# EAGLE board SANE v2 (EAGLE 7.6.0)
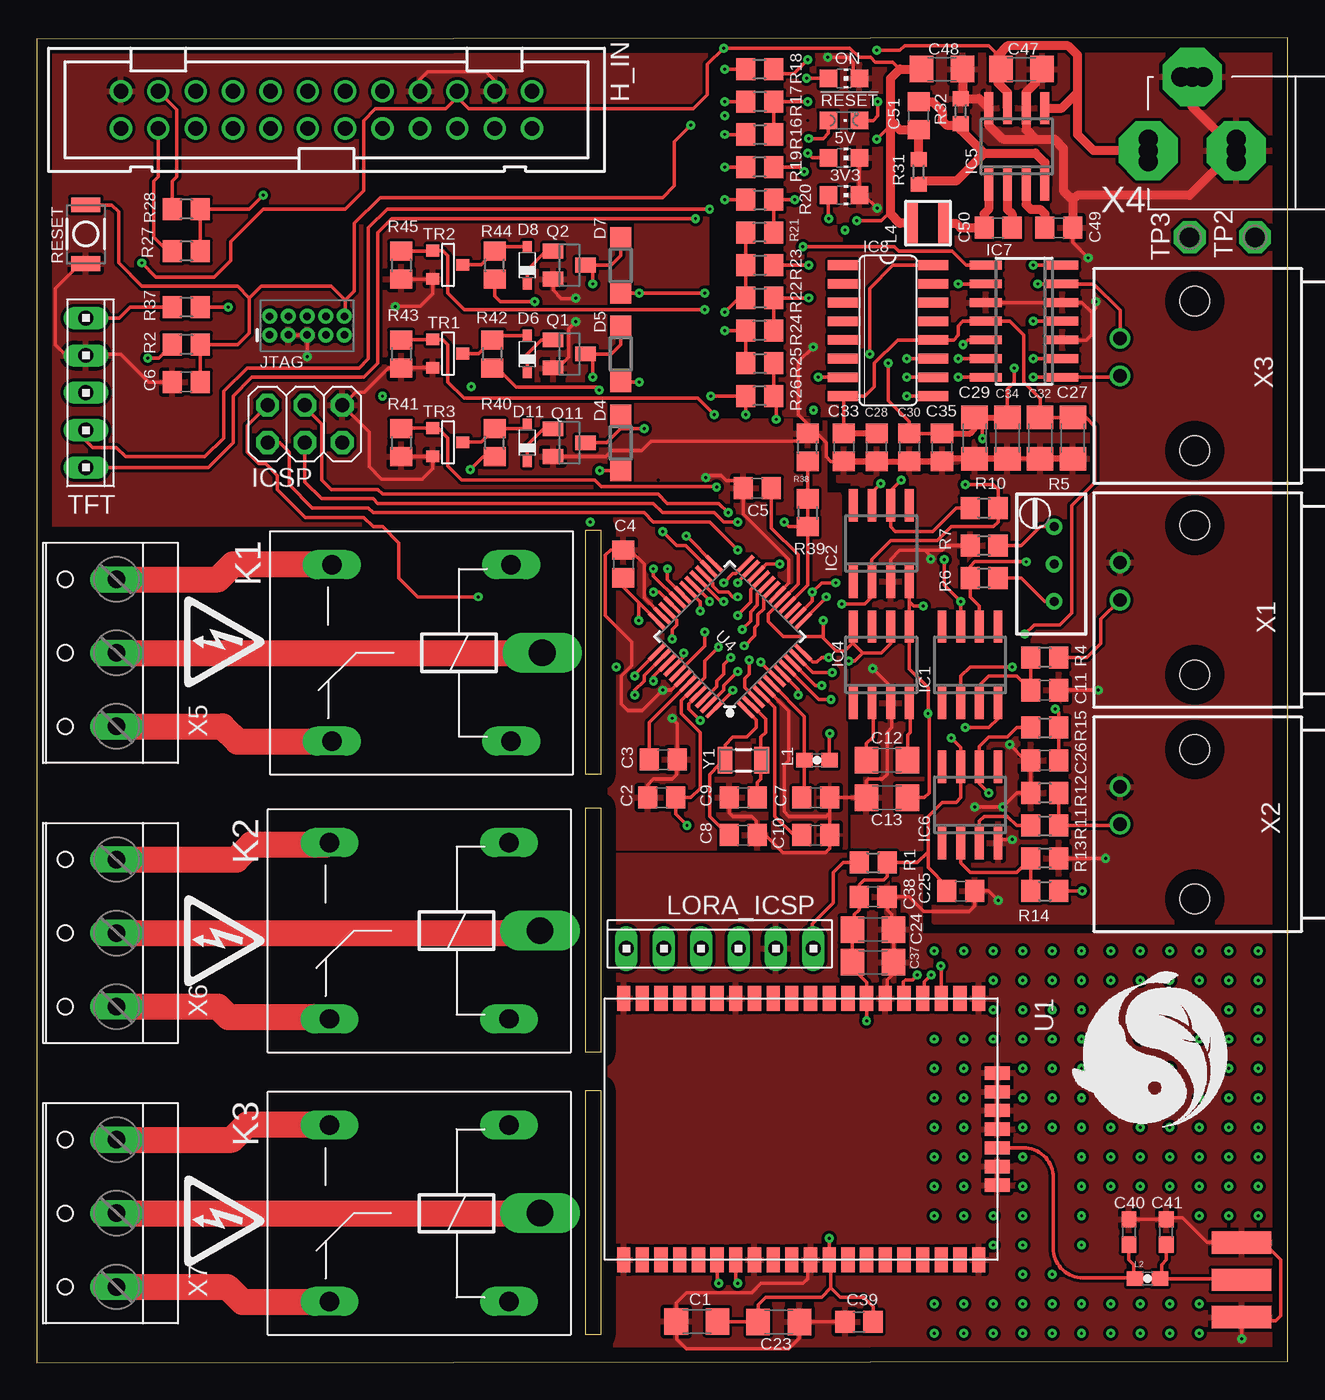
[diagram p1: board, top side]
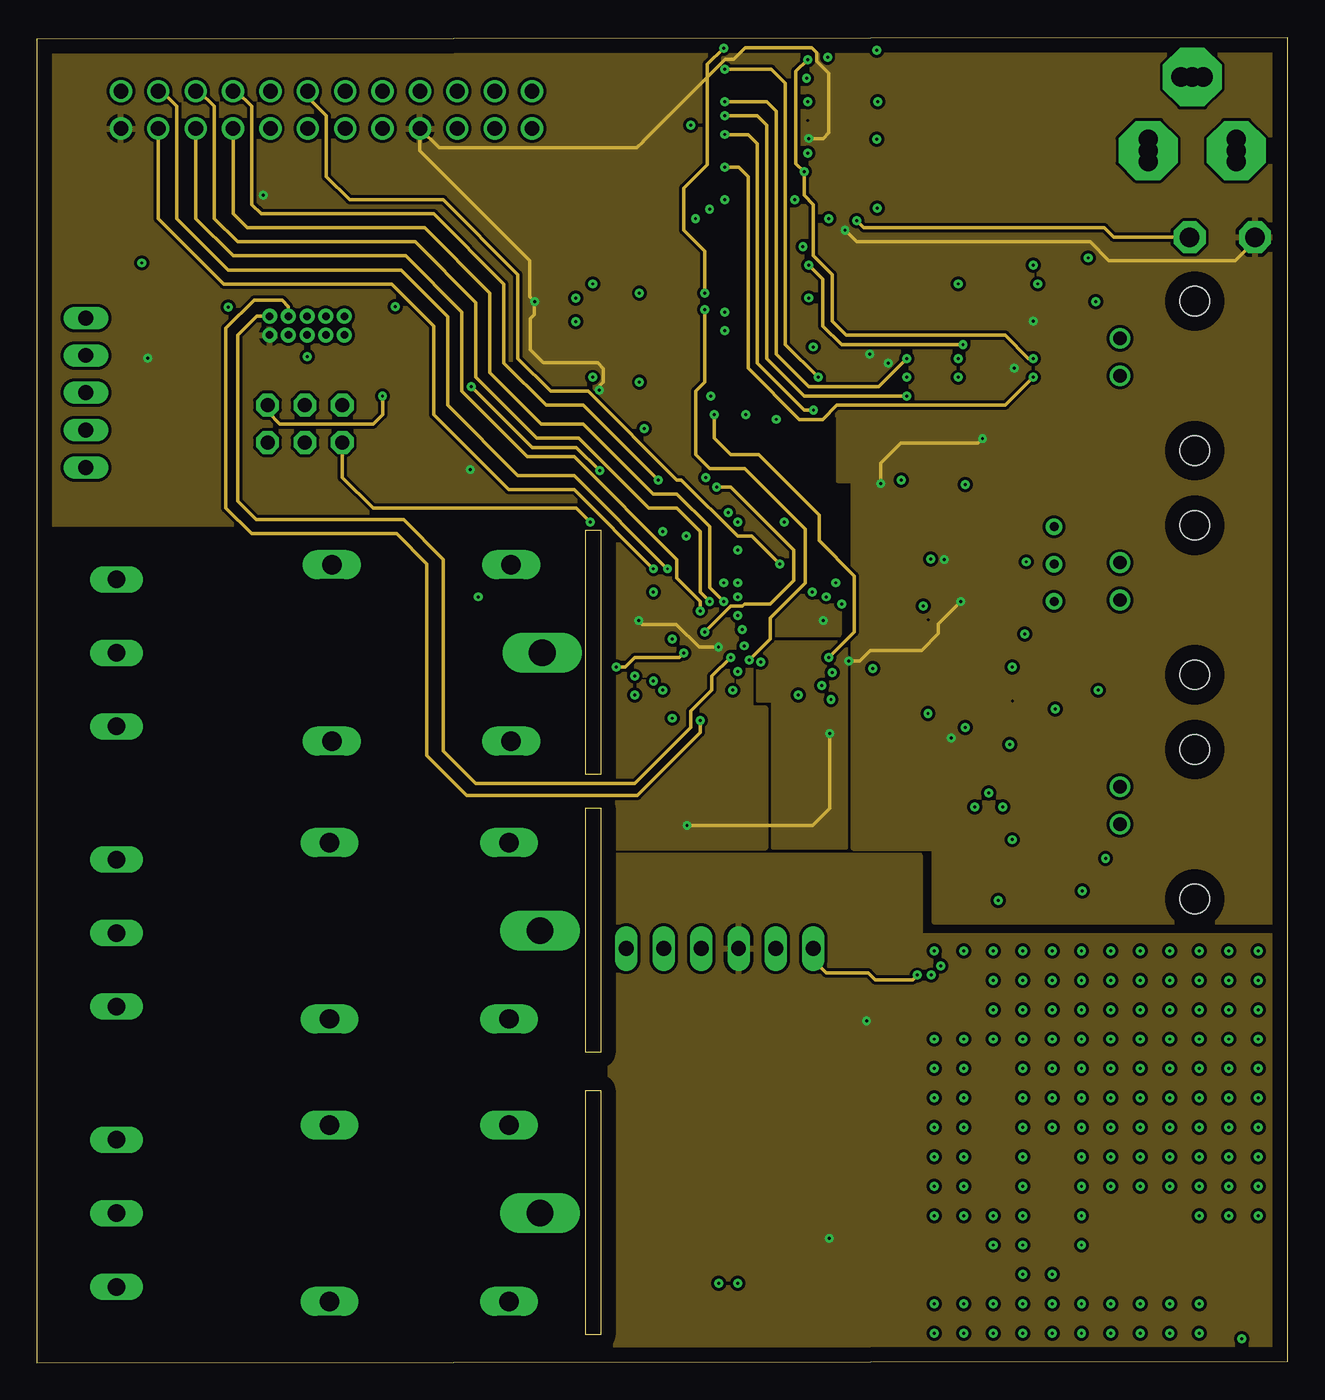
[diagram p2: board, inner layer Power]
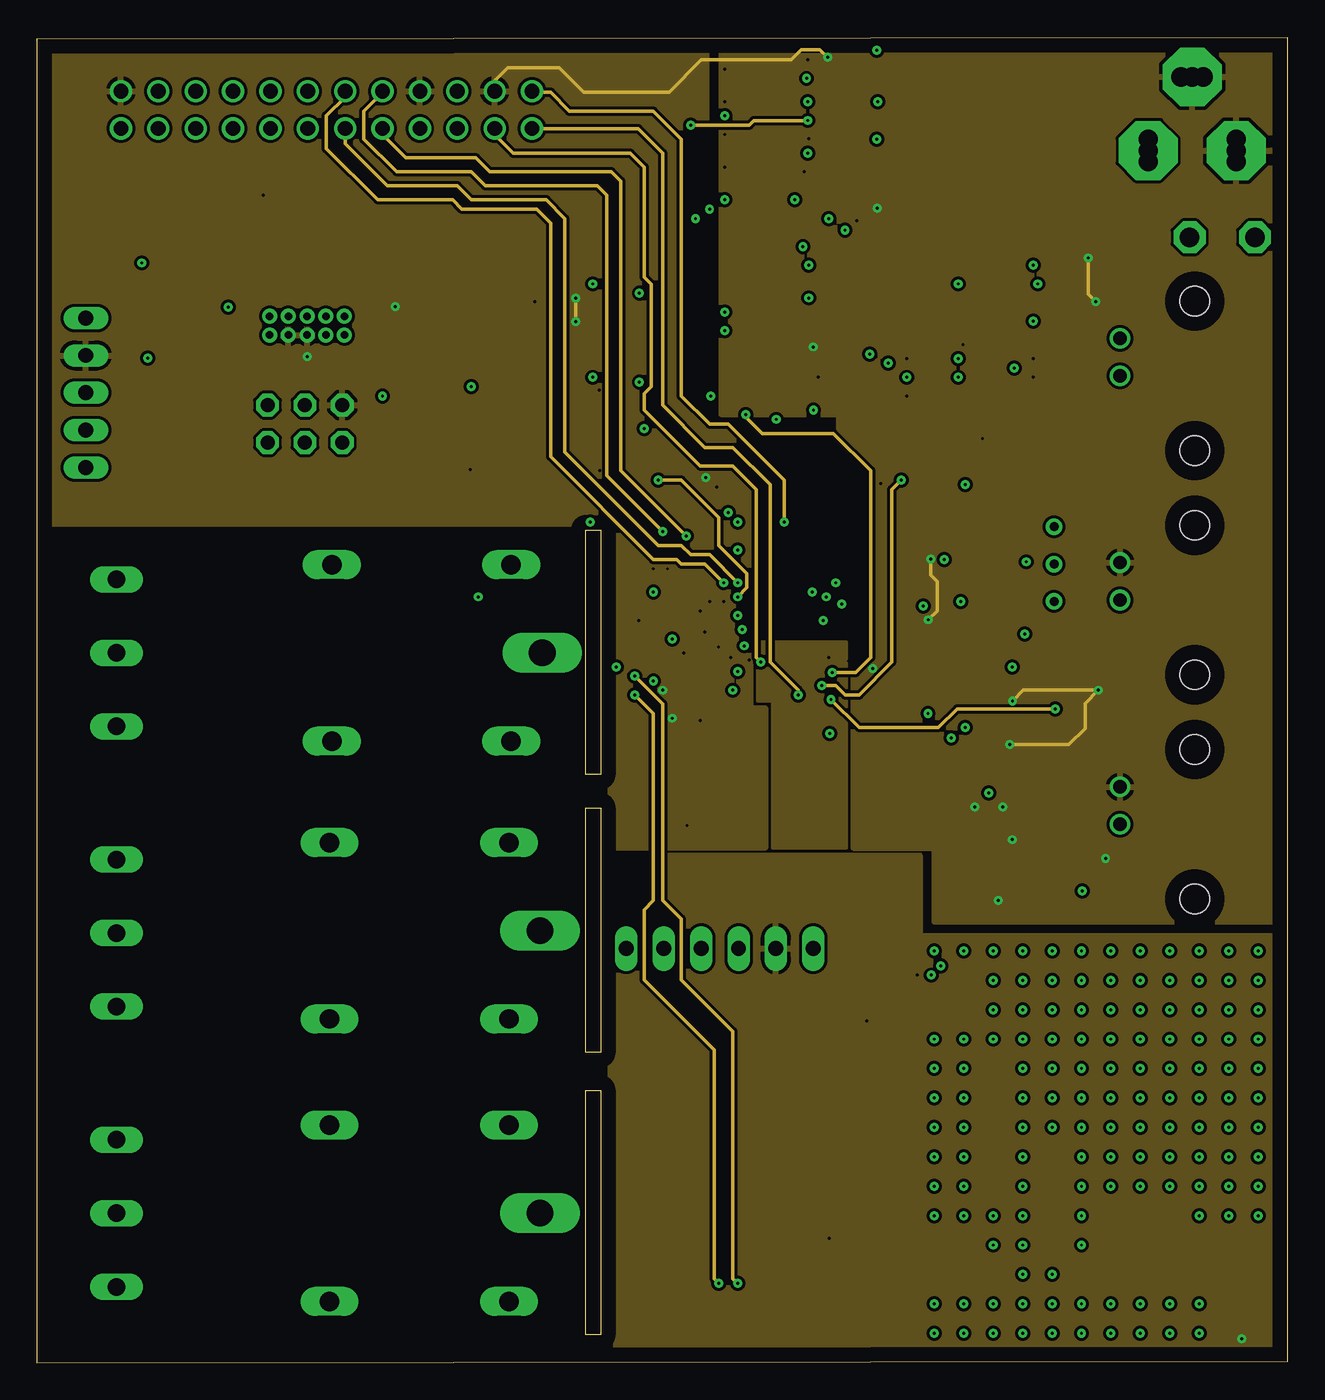
[diagram p3: board, inner layer Signals]
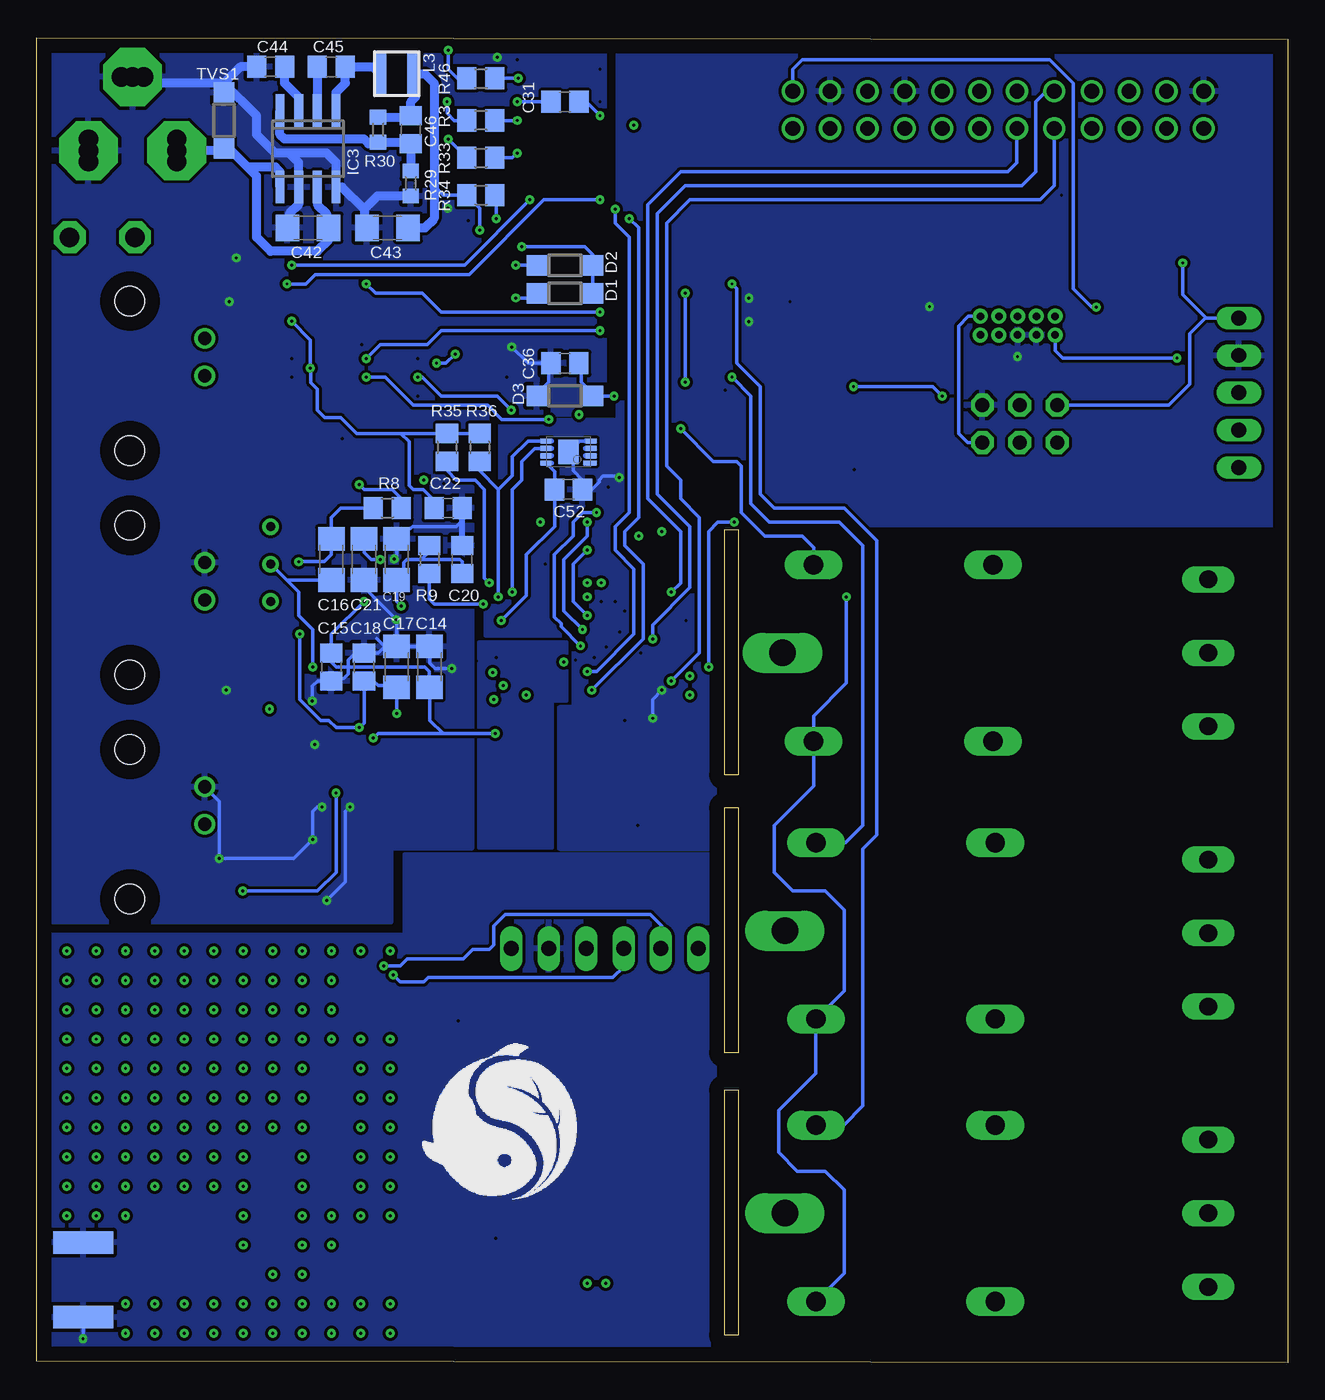
[diagram p4: board, bottom side, seen from below]

Size 85.03 x 90.08 mm. Coordinates in mm from the lower left corner, seen from the top.
Outline: 0,0 85.03,0.1 85.03,90.08 0,89.98 0,0
Outline: 37.32,18.52 38.32,18.52 38.32,1.89 37.32,1.89 37.32,18.52
Outline: 37.32,37.73 38.32,37.73 38.32,21.1 37.32,21.1 37.32,37.73
Outline: 37.32,56.62 38.32,56.62 38.32,39.99 37.32,39.99 37.32,56.62
Copper layers [2:(1*(2*15)*16):15]: Top 0.035mm / dielectric 0.2mm / Power 0.035mm / dielectric 0.3mm / Signals 0.035mm / dielectric 0.2mm / Bottom 0.035mm
Design rules "default *": minimum track width 10mil, minimum drill 24mil, track to track 8mil, track to pad 8mil, pad to pad 8mil, via to via 8mil, smd to smd 8mil, copper to edge 40mil, drill to drill 8mil, minimum pad ring 10mil, minimum via ring 8mil, stop-mask expansion 4mil, vias tented up to drill 0mil, thermal gap 10mil
Net classes: 0 default: width 0.203 mm, drill 0.406 mm, clearance 0.203 mm

## Footprints (pad centres in the part's own frame; a part is rotated, then mirrored left to right if it is on the bottom)
CHIP-LED0805 = smd 1.2 x 1.2: A 0,-1.05; C 0,1.05
CHIPLED_0805 = smd 1.2 x 1.2: A 0,-1.05; C 0,1.05
C1206 = smd 1.6 x 1.8: 1 -1.4,0; 2 1.4,0
C0805 = smd 1.3 x 1.5: 1 -0.95,0; 2 0.95,0
C0603 = smd 1.1 x 1: 1 -0.85,0; 2 0.85,0
SOD123 = smd 1.4 x 1.4: A 1.9,0; C -1.9,0
SOD323_ST = smd 0.8 x 0.6: A 1.25,0; C -1.25,0
PAK100/2500-24 = drill 1 pad 1.422: 1 -13.97,-1.27; 2 -13.97,1.27; 3 -11.43,-1.27; 4 -11.43,1.27; 5 -8.89,-1.27; 6 -8.89,1.27; 7 -6.35,-1.27; 8 -6.35,1.27; 9 -3.81,-1.27; 10 -3.81,1.27; 11 -1.27,-1.27; 12 -1.27,1.27; 13 1.27,-1.27; 14 1.27,1.27; 15 3.81,-1.27; 16 3.81,1.27; 17 6.35,-1.27; 18 6.35,1.27; 19 8.89,-1.27; 20 8.89,1.27; 21 11.43,-1.27; 22 11.43,1.27; 23 13.97,-1.27; 24 13.97,1.27
SO08 = smd 0.6 x 2.2: 1 -1.905,-2.6; 2 -0.635,-2.6; 3 0.635,-2.6; 4 1.905,-2.6; 5 1.905,2.6; 6 0.635,2.6; 7 -0.635,2.6; 8 -1.905,2.6
SO8 = smd 0.6 x 2.2: 1 -1.905,-2.6; 2 -0.635,-2.6; 3 0.635,-2.6; 4 1.905,-2.6; 5 1.905,2.6; 6 0.635,2.6; 7 -0.635,2.6; 8 -1.905,2.6
SO14 = smd 0.6 x 2.2: 1 -3.81,-2.6; 2 -2.54,-2.6; 3 -1.27,-2.6; 4 0,-2.6; 5 1.27,-2.6; 6 2.54,-2.6; 7 3.81,-2.6; 8 3.81,2.6; 9 2.54,2.6; 10 1.27,2.6; 11 0,2.6; 12 -1.27,2.6; 13 -2.54,2.6; 14 -3.81,2.6
SO16 = smd 0.66 x 2.032: 1 -4.445,-3.073; 2 -3.175,-3.073; 3 -1.905,-3.073; 4 -0.635,-3.073; 5 0.635,-3.073; 6 1.905,-3.073; 7 3.175,-3.073; 8 4.445,-3.073; 9 4.445,3.073; 10 3.175,3.073; 11 1.905,3.073; 12 0.635,3.073; 13 -0.635,3.073; 14 -1.905,3.073; 15 -3.175,3.073; 16 -4.445,3.073
2X03 = drill 0.95 pad 1.55 octagon: 1 -2.54,-1.27; 2 -2.54,1.27; 3 0,-1.27; 4 0,1.27; 5 2.54,-1.27; 6 2.54,1.27
2X5-PTH-1.27MM = drill 0.508 pad 1: 1 -2.54,-0.635; 2 -2.54,0.635; 3 -1.27,-0.635; 4 -1.27,0.635; 5 0,-0.635; 6 0,0.635; 7 1.27,-0.635; 8 1.27,0.635; 9 2.54,-0.635; 10 2.54,0.635
ZF112 = drill 1.321 long: 1 -6.096,5.994; 2 -6.096,-5.994; O 6.096,5.994; S 6.096,-5.994 | drill 1.803 long: P -8.204,0
0603 = smd 1.1 x 1: 1 -0.85,0; 2 0.85,0
L-NR3010 = smd 0.9 x 2.7: P$1 -1.15,0; P$2 1.15,0
10X06MTA = drill 1.016 long: 1 6.35,0; 2 3.81,0; 3 1.27,0; 4 -1.27,0; 5 -3.81,0; 6 -6.35,0
SOT23-BEC = smd 1 x 1.4: B -0.95,-1.1; C 0,1.1; E 0.95,-1.1
R0805 = smd 1.3 x 1.5: 1 -0.95,0; 2 0.95,0
RTRIMT93YA = drill 0.61: 1 0,-2.54; 2 0,0; 3 0,2.54
R0603 = smd 1 x 1.1: 1 -0.85,0; 2 0.85,0
SMD_157SW = smd 1.016 x 1.981: 1 0,0; 2 4,0
SMA-EDGE = smd 1.524 x 4.064: GND@0 0,0; GND@1 5.08,0; SIG 2.54,0 | smd 1.524 x 4.064 bottom: GND@2 0,0; GND@3 5.08,0
10X05MTA = drill 1.016 long: 1 5.08,0; 2 2.54,0; 3 0,0; 4 -2.54,0; 5 -5.08,0
P1-13 = drill 1.321 pad 2.159 octagon: TP 0,0
SOT-23 = smd 0.787 x 0.889: 1 0.025,-1.016; 2 -0.94,1.016; 3 0.991,1.016
RN2483/RN2903 = smd 1.7 x 0.9: 1 8.89,-12.7; 2 8.89,-11.43; 3 8.89,-10.16; 4 8.89,-8.89; 5 8.89,-7.62; 6 8.89,-6.35; 7 8.89,-5.08; 8 8.89,-3.81; 9 8.89,-2.54; 10 8.89,-1.27; 11 8.89,0; 12 8.89,1.27; 13 8.89,2.54; 14 8.89,3.81; 15 8.89,5.08; 16 8.89,6.35; 17 8.89,7.62; 18 8.89,8.89; 19 8.89,10.16; 20 8.89,11.43; 28 -8.89,11.43; 29 -8.89,10.16; 30 -8.89,8.89; 31 -8.89,7.62; 32 -8.89,6.35; 33 -8.89,5.08; 34 -8.89,3.81; 35 -8.89,2.54; 36 -8.89,1.27; 37 -8.89,0; 38 -8.89,-1.27; 39 -8.89,-2.54; 40 -8.89,-3.81; 41 -8.89,-5.08; 42 -8.89,-6.35; 43 -8.89,-7.62; 44 -8.89,-8.89; 45 -8.89,-10.16; 46 -8.89,-11.43; 47 -8.89,-12.7 | smd 0.9 x 1.7: 21 3.81,12.7; 22 2.54,12.7; 23 1.27,12.7; 24 0,12.7; 25 -1.27,12.7; 26 -2.54,12.7; 27 -3.81,12.7
SON50P300X200X60-9N-EP160X140 = smd 0.85 x 0.3: 1 -1.45,0.75 | smd 0.7 x 0.3: 2 -1.525,0.25; 3 -1.525,-0.25; 4 -1.525,-0.75; 5 1.525,-0.75; 6 1.525,-0.25; 7 1.525,0.25; 8 1.525,0.75 | smd 1.4 x 1.6: 9 0,0
TQFP-48 = smd 1.5 x 0.28: 1 -4.25,2.75; 2 -4.25,2.25; 3 -4.25,1.75; 4 -4.25,1.25; 5 -4.25,0.75; 6 -4.25,0.25; 7 -4.25,-0.25; 8 -4.25,-0.75; 9 -4.25,-1.25; 10 -4.25,-1.75; 11 -4.25,-2.25; 12 -4.25,-2.75; 25 4.25,-2.75; 26 4.25,-2.25; 27 4.25,-1.75; 28 4.25,-1.25; 29 4.25,-0.75; 30 4.25,-0.25; 31 4.25,0.25; 32 4.25,0.75; 33 4.25,1.25; 34 4.25,1.75; 35 4.25,2.25; 36 4.25,2.75 | smd 0.28 x 1.5: 13 -2.75,-4.25; 14 -2.25,-4.25; 15 -1.75,-4.25; 16 -1.25,-4.25; 17 -0.75,-4.25; 18 -0.25,-4.25; 19 0.25,-4.25; 20 0.75,-4.25; 21 1.25,-4.25; 22 1.75,-4.25; 23 2.25,-4.25; 24 2.75,-4.25; 37 2.75,4.25; 38 2.25,4.25; 39 1.75,4.25; 40 1.25,4.25; 41 0.75,4.25; 42 0.25,4.25; 43 -0.25,4.25; 44 -0.75,4.25; 45 -1.25,4.25; 46 -1.75,4.25; 47 -2.25,4.25; 48 -2.75,4.25
AMP_227161 = drill 0.9 pad 1.27: 1 0,-5.08; 2 -2.54,-5.08 | hole 2: -5.08,0; 5.08,0
POWERSUPPLY_DC-21MM = drill 1.3 pad 4 octagon: 1 -5.08,-3.353; 2 -0.076,-6.35; 3 -0.076,-0.356 | drill 1.3: 4 -5.08,-4.115; 5 -5.08,-2.591; 6 -0.838,-0.356; 7 0.686,-0.356; 8 -0.838,-6.35; 9 0.686,-6.35
W237-103 = drill 1.194 long: 1 -5,-1.29; 2 0,-1.29; 3 5,-1.29
CRYSTAL-SMD-3.2X1.5MM = smd 1 x 1.8: P$1 -1.25,0; P$2 1.25,0

## Placement (x,y rotation side)
3V3  GREEN  [CHIP-LED0805]  54.85,79.38 270 top
5V  GREEN  [CHIP-LED0805]  54.85,81.92 270 top
!RESET  [CHIPLED_0805]  54.85,84.45 270 top
C1  1u  [C1206]  44.86,2.8 180 top
C2  100n  [C0805]  42.47,38.42 180 top
C3  100n  [C0805]  42.58,41.01 0 top
C4  100n  [C0805]  39.86,54.31 90 top
C5  100n  [C0805]  48.97,59.45 180 top
C6  100n  [C0805]  10.16,66.67 180 top
C7  100n  [C0805]  52.94,38.42 180 top
C8  22p  [C0805]  48.02,35.88 180 top
C9  22p  [C0805]  48.02,38.42 0 top
C10  100n  [C0805]  52.94,35.88 180 top
C11  2.2n  [C0805]  68.5,45.72 0 top
C12  100u  [C1206]  57.78,40.96 0 top
C13  100u  [C1206]  57.78,38.42 180 top
C14  10u  [C1206]  58.34,47.31 270 bottom
C15  100n  [C0805]  65.01,47.31 90 bottom
C16  1u  [C1206]  65.01,54.61 90 bottom
C17  10u  [C1206]  60.57,47.31 270 bottom
C18  100n  [C0805]  62.79,47.31 270 bottom
C19  10u  [C1206]  60.57,54.61 270 bottom
C20  100n  [C0805]  56.12,54.61 270 bottom
C21  10u  [C1206]  62.79,54.61 90 bottom
C22  100n  [C0805]  57.08,58.1 180 bottom
C23  10u  [C1206]  50.42,2.77 0 top
C24  1u  [C1206]  56.83,29.45 0 top
C25  100n  [C0805]  62.79,32.07 180 top
C26  10n  [C0805]  68.5,40.96 180 top
C27  10u  [C1206]  70.41,62.87 90 top
C28  100n  [C0805]  57.08,62.23 90 top
C29  10u  [C1206]  63.74,62.87 90 top
C30  100n  [C0805]  59.3,62.23 90 top
C31  100n  [C0805]  49.13,85.72 180 bottom
C32  10u  [C1206]  68.19,62.87 90 top
C33  100n  [C0805]  54.85,62.23 90 top
C34  10u  [C1206]  65.97,62.87 90 top
C35  100n  [C0805]  61.52,62.23 90 top
C36  100n  [C0805]  49.14,67.94 180 bottom
C37  10u  [C1206]  56.83,27.23 0 top
C38  100n  [C0805]  56.83,31.67 0 top
C39  100n  [C0805]  55.88,2.78 180 top
C40  3.1p  [C0603]  74.22,8.89 90 top
C41  3.1p  [C0603]  76.76,8.89 90 top
C42  10u  [C1206]  66.6,77.15 180 bottom
C43  47u  [C1206]  61.2,77.15 0 bottom
C44  2.2u  [C0805]  69.14,88.11 180 bottom
C45  100n  [C0805]  65.01,88.1 0 bottom
C46  33p  [C0805]  59.62,83.82 90 bottom
C47  10u  [C1206]  66.92,87.95 0 top
C48  33u  [C1206]  61.52,87.95 180 top
C49  2.2u  [C0805]  69.46,77.15 0 top
C50  100n  [C0805]  65.33,77.15 180 top
C51  18p  [C0805]  59.93,84.77 270 top
C52  100n  [C0805]  48.9,59.37 0 bottom
D1  1n4148  [SOD123]  49.14,72.71 180 bottom
D2  1n4148  [SOD123]  49.13,74.61 0 bottom
D3  1n5819  [SOD123]  49.14,65.72 180 bottom
D4  1n4148  [SOD123]  39.69,62.55 90 top
D5  1n4148  [SOD123]  39.69,68.58 90 top
D6  BAT60J  [SOD323_ST]  33.34,68.58 90 top
D7  1n4148  [SOD123]  39.69,74.61 90 top
D8  BAT60J  [SOD323_ST]  33.34,74.61 90 top
D11  BAT60J  [SOD323_ST]  33.34,62.55 90 top
H_IN  2524-  [PAK100/2500-24]  19.69,85.18 0 top
IC1  CA3140D  [SO08]  63.42,47.45 0 top
IC2  TL081D  [SO08]  57.39,55.7 0 top
IC3  LMR23625-Q1  [SO08]  66.6,82.53 180 bottom
IC4  TC1121COA  [SO8]  57.39,47.45 0 top
IC5  LMR23625-Q1  [SO08]  66.6,82.69 0 top
IC6  TP5551  [SO8]  63.42,37.92 0 top
IC7  TL034CD  [SO14]  67.09,70.8 90 top
IC8  4060D  [SO16]  57.85,70.17 270 top
ICSP  3x2 M  [2X03]  18.22,63.83 0 top
JTAG  CORTEX_DEBUGPTH  [2X5-PTH-1.27MM]  18.37,70.5 0 top
K1  ZF112  [ZF112]  26.15,48.26 180 top
K2  ZF112  [ZF112]  25.99,29.37 180 top
K3  ZF112  [ZF112]  25.99,10.16 180 top
L1  10u  [0603]  53.02,40.96 180 top
L2  4.7n  [0603]  75.49,5.71 0 top
L3  2.2uH  [L-NR3010]  60.57,87.63 0 bottom
L4  2.2uH  [L-NR3010]  60.57,77.47 180 top
LORA_ICSP  [10X06MTA]  46.42,28.15 0 top
ON  GREEN  [CHIP-LED0805]  54.85,87.31 270 top
Q1  BC849SMD  [SOT23-BEC]  36.2,68.58 270 top
Q2  BC849SMD  [SOT23-BEC]  36.2,74.61 270 top
Q11  BC849SMD  [SOT23-BEC]  36.2,62.55 270 top
R1  10k  [R0805]  56.84,34 0 top
R2  10k  [R0805]  10.16,69.22 180 top
R3  220  [R0805]  54.85,84.45 180 bottom
R4  4.7M  [R0805]  68.5,47.94 180 top
R5  5k  [RTRIMT93YA]  69.14,54.29 0 top
R6  2.2k  [R0805]  64.38,53.34 180 top
R7  1k  [R0805]  64.38,55.56 0 top
R8  30k  [R0805]  61.2,58.1 0 bottom
R9  75k  [R0805]  58.34,54.61 270 bottom
R10  30k  [R0805]  64.38,58.1 0 top
R11  4.7k  [R0805]  68.5,36.51 0 top
R12  7.5k  [R0805]  68.5,38.73 180 top
R13  8.2k  [R0805]  68.5,34.29 180 top
R14  300k  [R0805]  68.5,32.07 0 top
R15  220  [R0805]  68.5,43.18 0 top
R16  10k  [R0805]  49.14,83.5 0 top
R17  100k  [R0805]  49.14,85.72 180 top
R18  51k  [R0805]  49.13,87.95 0 top
R19  2k  [R0805]  49.13,81.28 180 top
R20  820  [R0805]  49.14,79.06 0 top
R21  36k  [R0805]  49.13,76.83 180 top
R22  36k  [R0805]  49.14,72.39 0 top
R23  36k  [R0805]  49.14,74.61 0 top
R24  36k  [R0805]  49.13,70.17 180 top
R25  36k  [R0805]  49.14,67.94 0 top
R26  10k  [R0805]  49.13,65.72 180 top
R27  10k  [R0805]  10.16,75.56 180 top
R28  10k  [R0805]  10.16,78.42 180 top
R29  22.1k  [R0603]  59.62,80.17 90 bottom
R30  51k  [R0603]  61.84,83.82 90 bottom
R31  88.7k  [R0603]  59.93,80.96 90 top
R32  22.1k  [R0603]  62.79,85.09 270 top
R33  1k  [R0805]  54.85,81.92 0 bottom
R34  330  [R0805]  54.85,79.38 0 bottom
R35  10k  [R0805]  57.15,62.23 270 bottom
R36  10k  [R0805]  54.93,62.23 270 bottom
R37  10k  [R0805]  10.16,71.75 180 top
R38  10k  [R0805]  52.39,62.23 90 top
R39  10k  [R0805]  52.39,57.78 270 top
R40  4k7  [R0805]  31.11,62.55 90 top
R41  330  [R0805]  24.77,62.55 270 top
R42  4k7  [R0805]  30.96,68.58 90 top
R43  330  [R0805]  24.77,68.58 270 top
R44  4k7  [R0805]  31.11,74.61 90 top
R45  330  [R0805]  24.77,74.61 270 top
R46  4,7k  [R0805]  54.85,87.31 0 bottom
RESET  RESET  [SMD_157SW]  3.33,74.71 90 top
SMA_GPS  SMA_EDGE  [SMA-EDGE]  81.88,3.1 90 top
TFT  [10X05MTA]  3.33,65.94 270 top
TP2  TPPAD1-13  [P1-13]  82.79,76.52 0 top
TP3  TPPAD1-13  [P1-13]  78.35,76.52 0 top
TR1  Q100  [SOT-23]  27.94,68.58 90 top
TR2  Q100  [SOT-23]  27.94,74.61 90 top
TR3  Q100  [SOT-23]  27.94,62.55 90 top
TVS1  [SOD123]  72.31,84.45 90 bottom
U1  [RN2483/RN2903]  52.58,15.88 270 top
U3  ECC508  [SON50P300X200X60-9N-EP160X140]  48.9,61.91 180 bottom
U4  ATSAMD21G-A  [TQFP-48]  47.11,49.36 135 top
U$1  SHOCK  [SHOCK]  9.68,52.07 270 top
U$2  SHOCK  [SHOCK]  9.68,31.75 270 top
U$3  LOGO-SANE  [LOGO-SANE]  70.96,15.72 0 top
U$4  LOGO-SANE  [LOGO-SANE]  58.26,10.79 0 bottom
U$9  SHOCK  [SHOCK]  9.68,12.7 270 top
X1  1-227161-0  [AMP_227161]  78.7,51.85 270 top
X2  1-227161-0  [AMP_227161]  78.7,36.61 270 top
X3  1-227161-0  [AMP_227161]  78.7,67.09 270 top
X4  POWERSUPPLY_DC21MMX  [POWERSUPPLY_DC-21MM]  81.88,82.33 270 top
X5  [W237-103]  4.13,48.26 90 top
X6  [W237-103]  4.13,29.21 90 top
X7  [W237-103]  4.13,10.16 90 top
Y1  32.768kHz  [CRYSTAL-SMD-3.2X1.5MM]  48.02,40.96 180 top

## Tracks (layer width: path | path; a pad name or v marks a point on that pad's centre or on a via)
4060_CLK  (via drill 0.2)
  Top 0.254: R16.2 R17.1 v52.39,85.72
  Bottom 0.254: v52.39,85.72 C31.2
!RESET  (via drill 0.2, 0.2 layers 1-2, 0.2 layers 15-16)
  Top 0.254: C6.1 R2.1 13.65,69.22 14.45,70.01 14.45,72.39 | 14.45,72.39 15.24,73.18 20,73.18 20.95,72.23 | 20.95,72.23 20.95,71.18 JTAG.10 | v43.97,48.26 43.97,48 U4.40 | RESET.2 5.11,78.71 5.56,78.26 5.56,74.77 7.14,73.18 13.65,73.18 14.45,72.39 | 20.95,72.23 21.59,72.87 21.59,77.47 23.34,79.22 42.55,79.22 43.34,80.01 43.34,83.03 v44.45,84.14
  Power 0.254: v39.37,47.31 40.01,47.31 40.64,47.94 43.66,47.94 v43.97,48.26 | v37.62,57.15 36.67,58.1 22.86,58.1 20.77,60.19 20.77,62.55 ICSP.5
  Signals 0.254: v52.39,84.45 48.74,84.45 48.42,84.14 v44.45,84.14
  Bottom 0.254: JTAG.10 21.73,71.14 22.38,70.48 22.38,63.18 21.75,62.55 20.77,62.55 ICSP.5 | v39.37,47.31 39.37,56.52 38.73,57.15 v37.62,57.15 | R3.1 v52.39,84.45
+3V3  (via drill 0.2, 0.2 layers 1-2)
  Top 0.254: C25.2 61.84,32.38 60.57,33.66 60.57,34.74 | 60.57,34.74 60.57,37.15 61.52,38.1 62.47,38.1 62.79,38.42 IC6.7 62.79,41.82 v62.15,42.46 | IC1.7 v62.79,51.75 61.68,52.86 v61.68,54.61 | 56.12,48.26 55.49,48.9 IC4.8 55.49,48.97 54.91,48.39 54.33,48.39 53.72,49 53.72,49.01 53.46,49.27 | IC4.6 58.03,48.9 57.39,48.26 56.12,48.26 | C35.2 C30.2 59.3,63.97 57.87,65.41 v57.87,67.94 | C34.2 65.97,66.2 66.44,66.67 v66.44,67.63 | v67.71,70.8 IC7.4 | v56.59,68.58 56.59,73.03 58.18,74.61 IC8.16 | C1.1 46.29,2.77 C23.1 49.02,3.94 49.53,4.45 53.34,4.45 53.98,5.08 | C39.1 56.83,3.81 56.2,4.45 54.61,4.45 53.98,5.08 | 53.98,5.08 53.98,6.87 U1.12 v53.85,8.45 | C4.1 39.86,52.72 40.91,51.67 | 40.91,51.67 U4.36 | C5.1 49.92,56.76 51.75,54.93 51.75,52.95 U4.17 49.71,50.9 49.71,50.39 50.74,49.36 53.37,49.36 53.46,49.27 | R27.1 R28.1 14.44,78.42 v15.39,79.37 | 60.57,34.74 59.83,34 R1.2 57.79,33.07 57.55,32.83 56.22,32.83 55.88,32.49 C38.1 55.88,30.8 55.56,30.48 55.56,29.58 C24.1 C37.1 55.88,26.78 55.88,26.35 56.39,25.84 U1.34 v56.39,23.23 | L1.1 v53.87,42.77 v53.88,42.78 | R44.1 31.11,72.5 31.49,72.13 v33.83,72.13 v33.84,72.14 | R40.1 30.33,61.6 v29.46,60.73 | v7.54,68.29 8.29,68.29 R2.2 | !RESET.A 53.8,83.59 53.44,83.23 v52.47,83.23 | v53.46,50.45 53.46,49.27 | v46.33,48.65 45.4,47.72 45.4,46.58 44.65,45.83 U4.44 43.81,45.01 43.81,44.13 45.09,42.86 45.09,39.05 44.45,38.42 C2.1 43.41,37.31 v44.19,36.54 | v40.91,50.45 40.91,51.67 | 56.12,48.26 55.58,47.72 v55.18,47.72 v55.17,47.71 | IC2.7 56.76,59.17 v57.36,59.77 | v64.27,62.83 64.27,63.74 C29.2 | R42.1 31.28,67.63 32.6,66.31 38.04,66.31 v38.23,66.12
  Top 0.406: C35.2 63.42,63.18 63.74,63.5 C29.2 C34.2
  Power 0.254: TP2.TP 82.79,76.28 81.44,74.93 72.87,74.93 71.6,76.2 55.72,76.2 v54.93,76.99 | v56.39,23.23 56.33,23.23 | v53.85,8.45 53.85,8.6 53.84,8.61 | v29.46,60.73 v29.46,60.72 29.42,60.68 | v15.39,79.37 15.39,79.48 | v46.33,48.65 45.01,48.65 43.46,50.2 41.16,50.2 v40.91,50.45 | v55.17,47.71 55.92,47.71 56.63,48.42 60.13,48.42 61.27,49.56 61.27,50.23 v62.79,51.75 | v44.19,36.54 52.73,36.54 53.88,37.69 v53.88,42.78 | v57.36,59.77 57.36,61.17 58.7,62.51 63.95,62.51 v64.27,62.83 | v52.47,83.23 53.44,83.23 53.82,83.61 53.82,87.67 53.01,88.48 53.01,89.06 52.67,89.4 48.15,89.4 47.36,88.61 46.78,88.61 41.2,83.03 41.2,83.02 40.79,82.61 27.34,82.61 H_IN.17 26.04,82.39 33.49,74.94 33.49,72.49 v33.84,72.14 33.82,72.12 33.82,71.25 33.54,70.97 33.54,68.87 34.43,67.98 38.12,67.98 38.5,67.6 38.5,66.67 38.23,66.4 v38.23,66.12
  Bottom 0.254: v62.79,51.75 65.01,49.53 C15.2 65.01,47.62 64.69,47.31 58.66,47.31 58.34,46.99 C14.2 58.31,45.87 58.31,43.67 57.42,42.78 | C21.2 62.79,55.09 62.31,54.61 v61.68,54.61 | 58.03,80.01 57.39,79.38 R34.1 54.93,78.5 v54.93,76.99 | v67.71,70.8 66.44,69.53 v66.44,67.63 66.41,67.6 66.41,66.64 65.97,66.2 65.97,64.77 65.46,64.27 64.37,64.27 63.28,63.18 60.3,63.18 | v57.87,67.94 57.23,67.94 v56.59,68.58 | R36.1 R35.1 60.3,63.18 | U3.8 49.84,60.59 C52.1 49.84,56.84 51.75,54.93 51.75,52.16 v53.46,50.45 | v53.88,42.78 57.42,42.78 | JTAG.1 15.83,68.8 15.32,68.29 v7.54,68.29 | v62.15,42.46 v62.14,42.46 61.82,42.78 57.42,42.78 | C22.2 58.02,58.62 58.77,59.36 59.45,59.36 59.73,59.64 59.73,62.61 60.3,63.18
  Bottom 0.61: C43.2 58.66,77.15 58.03,77.79 58.03,80.01 58.03,87 58.66,87.63 L3.P$2 59.3,87.51 59.3,86.04 59.62,85.72 C46.2 59.72,84.67 R30.2
  pour Power: 39,34.5 60,34.5 60,29 85,29 85,0 39,0
  pour Power: 49.5,43.5 49.5,35 39,35 39,57 0,57 0,90 45.5,90 45.5,64 53.5,64 53.5,59 54.5,59 54.5,49.5 48.5,49.5 48.5,44.5 49.5,44.5
  pour Power: 49,46 49,48 49,49 55,49 55,35 50,35 50,44 50,45 49,45
  pour Power: 55.5,35 61,35 61,30 85,30 85,90 46.5,90 46.5,64.5 54.5,64.5 54.5,60 55.5,60
+5V  (via drill 0.2, 0.2 layers 1-2)
  Top 0.254: v57.08,83.19 58.03,84.14 | TFT.5 5.62,71.02 6.35,71.75 R37.2 | v55.72,77.63 57.39,77.63 58.03,78.26 | D7.C v40.95,72.71 v40.96,72.71 v45.4,72.71 | v40.96,66.67 D5.C | 58.66,87.95 58.19,88.42 56.99,88.42 56.67,88.74 55.88,88.74 55.24,89.38 v46.67,89.38 45.56,88.27 45.56,86.2 44.61,85.25 29.37,85.25 28.58,86.04 28.58,86.05 | D4.C v38.26,60.65 v38.26,60.64 | H_IN.20 28.58,86.05 | 28.58,86.05 27.78,85.25 23.02,85.25 22.23,84.45 22.23,79.69 20.95,78.42 15.4,78.42 13.18,76.2 13.18,74.93 12.06,73.82 8.1,73.82 v7.14,74.77 | v30,52.07 25.88,52.07 24.61,53.34 24.61,55.72 23.5,56.83 22.86,56.83 22.23,57.47 18.26,57.47 16.35,59.37 16.35,60.33 15.56,61.12 15.08,61.12 14.29,61.91 14.29,63.7 ICSP.2
  Top 0.61: R31.2 C51.2 58.66,83.82 58.03,84.45 | L4.P$2 58.66,77.47 58.03,78.11 58.03,78.26 58.03,84.14 58.03,84.45 | 58.03,84.45 58.03,87.31 58.66,87.95 C48.2
  Power 0.254: TP3.TP 73.18,76.52 72.55,77.15 56.2,77.15 v55.72,77.63 | v45.4,72.71 45.4,75.56 43.97,76.99 43.97,79.85 45.56,81.44 45.56,88.27 v46.67,89.38 | v38.26,60.64 36.67,62.23 33.66,62.23 v29.53,66.36 | v23.5,65.72 23.5,64.45 22.86,63.82 16.51,63.82 15.72,64.61 15.72,65.07 ICSP.2
  Bottom 0.254: R33.1 v57.08,83.19 | K3.1 30.16,6.09 30.16,11.75 31.43,13.02 33.34,13.02 34.61,14.29 34.61,17.14 32.08,19.67 K2.1 30.16,25.3 30.16,30.8 31.43,32.07 33.66,32.07 34.92,33.34 34.92,36.51 32.24,39.2 K1.1 32.24,43.96 30,46.2 v30,52.07 | ICSP.2 8.09,65.1 6.67,66.52 6.67,69.97 5.62,71.02 5.56,71.02 | 5.56,71.02 TFT.5 | v40.96,72.71 v40.96,66.67 | v29.53,66.36 24.13,66.36 v23.5,65.72 | v7.14,74.77 7.14,72.61 5.56,71.02
+12V  (via drill 0.2)
  Top 0.254: v57.08,89.22 58.66,89.22 58.98,89.53 64.69,89.53 65.33,88.9
  Top 0.61: IC5.7 65.97,86.36 65.33,87 65.33,87.76 C47.1 65.33,88.14 65.33,88.9 65.97,89.53 70.09,89.53 70.73,88.9 70.73,86.36 | IC5.5 69.66,85.29 70.73,86.36 | X4.2 71.82,82.41 70.73,83.5 70.73,86.36
  Bottom 0.254: R46.1 56.44,87.31 57.08,87.95 v57.08,89.22
  Bottom 0.406: 71.82,82.41 72.31,82.41 TVS1.C
  Bottom 0.61: IC3.7 65.97,78.74 65.33,78.11 65.33,77.28 C42.1 65.2,76.33 65.97,75.56 69.14,75.56 70.09,76.52 70.09,80.68 70.69,81.28 | IC3.5 68.5,80.96 68.82,81.28 70.69,81.28 | 70.69,81.28 71.82,82.41 X4.2
-3V3  (via drill 0.2)
  Top 0.254: IC1.4 65.33,43.81 64.69,43.18 v63.11,43.18 | 59.3,51.75 IC4.5 59.3,47.18 C17.2 v60.57,44.13 60.64,44.06 60.64,38.73 60.33,38.42 C13.1 | 59.3,51.75 IC2.4 | v60.25,51.44 59.62,51.44 59.3,51.75 | C33.2 54.85,65.65 IC8.8 56.28,65.72 56.91,66.36 56.91,67.94 58.5,69.53 IC8.12 62.31,69.53 62.63,69.85 62.63,70.48 62.95,70.8 IC7.11 66.12,70.8 67.07,69.85 67.07,66.67 68.19,65.56 C32.2 C27.2 71.31,64.27 71.91,63.66 71.91,59.85 70.33,58.26 70.33,50.96 69.53,50.16 67.79,50.16 v67.15,49.53
  Top 0.406: C28.2 C33.2
  Bottom 0.254: v60.57,44.13 C17.2 60.7,46.04 61.84,46.04 62.16,46.36 C18.2 62.79,43.5 v63.11,43.18 64.69,43.18 65.17,43.66 65.72,43.66 67.15,45.09 v67.15,49.53 | C20.2 56.12,54.45 56.28,54.61 58.9,54.61 | v60.25,51.44 60.57,51.75 C19.2 60.09,53.69 60.09,54.4 59.88,54.61 58.9,54.61 | R9.1 58.34,55.16 58.9,54.61
CA3140-  (via drill 0.2)
  Top 0.254: IC1.2 62.79,46.67 63.42,47.31 v66.28,47.31
  Bottom 0.254: v66.28,47.31 66.28,49.85 67.23,50.8 67.23,52.39 68.06,53.21 | C16.1 68.06,53.21 | 68.06,53.21 R5.2
CA3140REL  (via drill 0.2)
  Top 0.254: IC1.6 64.06,51.44 63.43,52.07 R6.2 63.43,54.14 63.74,54.45 v67.23,54.45
  Bottom 0.254: R8.1 64.38,58.1 65.01,57.47 C16.2 65.01,54.93 65.49,54.45 v67.23,54.45
CT1  (via drill 0.2 layers 1-2)
  Top 0.254: X3.1 73.52,66.99 IC7.1 v67.71,66.99 | R19.2 v46.75,81.28
  Power 0.254: v46.75,81.28 47.7,81.28 48.34,80.64 48.34,67.63 51.83,64.14 53.42,64.14 54.37,65.09 65.8,65.09 v67.71,66.99
CT2  (via drill 0.2)
  Top 0.254: X3.2 73.62,71.56 71.83,73.34 IC7.6 v68.03,73.34 | R20.1 v46.75,79.06
  Bottom 0.254: v46.75,79.06 50.56,79.06 55.64,73.98 66.12,73.98 66.75,73.34 v68.03,73.34
D0  (via drill 0.2)
  Top 0.254: v42.55,56.52 43.5,55.56 44.09,55.56 U4.26
  Signals 0.254: H_IN.16 23.5,86.36 22.23,85.09 22.23,83.19 24.45,80.96 29.53,80.96 30.48,80.01 38.1,80.01 38.73,79.38 38.73,60.33 v42.55,56.52
D1  (via drill 0.2)
  Top 0.254: v44.13,56.2 44.16,56.2 U4.25
  Signals 0.254: H_IN.15 23.5,83.5 25.08,81.92 29.84,81.92 30.8,80.96 39.05,80.96 39.69,80.33 39.69,60.64 v44.13,56.2
D2  (via drill 0.2)
  Top 0.254: v46.67,53.02 47.31,53.66 47.51,53.66 U4.24
  Signals 0.254: H_IN.14 20.96,86.05 19.68,84.77 19.68,82.55 23.18,79.06 28.26,79.06 28.89,78.42 33.97,78.42 34.92,77.47 34.92,61.59 41.91,54.61 43.5,54.61 43.81,54.29 45.4,54.29 v46.67,53.02
D3  (via drill 0.2)
  Top 0.254: v47.62,53.02 47.62,53.06 U4.23
  Signals 0.254: H_IN.13 20.96,82.86 23.81,80.01 28.57,80.01 29.53,79.06 34.61,79.06 35.88,77.79 35.88,61.91 42.23,55.56 43.81,55.56 44.45,54.93 45.72,54.93 v47.62,53.02
D4  (via drill 0.2 layers 1-2)
  Top 0.254: v50.48,54.29 49.56,54.29 U4.22
  Power 0.254: H_IN.12 18.42,86.04 19.68,84.77 19.68,80.64 21.27,79.06 27.62,79.06 32.7,73.98 32.7,68.26 34.92,66.04 37.47,66.04 43.5,60.01 43.81,60.01 47.62,56.2 48.58,56.2 v50.48,54.29
D5  (via drill 0.2)
  Top 0.254: v41.91,52.39 42.31,52.39 U4.33
  Bottom 0.254: v41.91,52.39 41.27,53.02 41.27,56.52 43.5,58.74 43.5,78.74 41.27,80.96 19.05,80.96 18.42,81.59 H_IN.11
D6  (via drill 0.2)
  Top 0.254: v43.18,49.21 43.18,49.85 43.5,50.16 43.5,50.5 U4.34
  Bottom 0.254: v43.18,49.21 43.18,50.16 40.64,52.7 40.64,56.83 42.55,58.74 42.86,59.05 42.86,78.11 40.96,80.01 18.1,80.01 17.14,80.96 17.14,85.72 16.42,86.45 H_IN.10
D7  (via drill 0.2)
  Top 0.254: v41.91,46.35 41.91,46.64 U4.39
  Bottom 0.254: H_IN.9 15.88,80.01 16.83,79.06 40.64,79.06 42.23,77.47 42.23,60.96 41.27,60.01 41.27,58.74 40.01,57.47 40.01,48.26 v41.91,46.35
EC_OUT  (via drill 0.2)
  Top 0.254: v45.8,65.72 R26.2 v48.18,64.45 | v54.05,46.91 52.74,46.91 U4.11
  Signals 0.254: v48.18,64.45 48.18,64.29 49.29,63.18 54.13,63.18 56.67,60.64 56.67,47.94 55.64,46.91 v54.05,46.91
  Bottom 0.254: C36.1 48.02,67.78 48.02,66.67 47.24,65.89 D3.C v45.8,65.72
ECHO  (via drill 0.2)
  Top 0.254: v49.21,47.62 v49.21,47.61 U4.7
  Signals 0.254: H_IN.21 31.12,83.5 32.38,82.23 40.32,82.23 41.27,81.28 41.27,73.82 41.75,73.34 41.75,66.36 41.27,65.88 41.27,64.77 45.09,60.96 47.31,60.96 48.9,59.37 48.9,47.94 v49.21,47.62
GND  (via drill 0.2, 0.2 layers 15-16, 0.2 pad 0.25)
  Top 0.254: v65.33,31.43 64.69,32.07 C25.1 63.75,32.06 63.75,31.04 63.38,30.67 60.28,30.67 59.28,31.67 C38.2 57.78,30.8 58.1,30.48 58.1,29.58 C24.2 C37.2 58.23,26.48 57.78,26.04 57.78,24.89 U1.33 | v63.74,37.78 v65.65,37.78 66.6,38.73 R12.2 C26.2 67.19,40.96 v66.13,42.02 | v66.28,35.56 65.57,35.56 IC6.4 | R13.1 v72.63,34.29 | IC2.3 58.03,54.61 58.66,55.24 60.36,55.24 | R7.1 61.84,55.56 61.52,55.24 60.36,55.24 | 5V.C 3V3.C 56.22,79.38 v57.11,78.48 | C34.1 C32.1 | C40.2 C41.2 76.86,9.84 77.87,9.84 79.53,8.18 SMA_GPS.GND@3 83.34,8.18 84.53,6.99 84.53,3.17 84.22,2.86 82.11,2.86 SMA_GPS.GND@2 81.89,3.08 v81.89,1.62 | U1.27 U1.26 U1.25 U1.24 | U1.22 U1.21 | C39.2 51.83,2.78 | 51.83,2.78 C23.2 | U1.11 52.39,6.79 52.39,5.71 52.07,5.4 49.21,5.4 48.58,4.76 44.13,4.76 43.46,4.09 C1.2 43.5,2.76 43.5,1.59 44.13,0.95 51.12,0.95 51.83,1.67 51.83,2.78 | C9.1 47.07,37.38 47.31,37.15 48.58,37.15 48.9,36.83 48.9,35.95 | C7.1 C10.1 53.9,34.96 53.63,34.69 50.7,34.69 49.44,35.95 48.9,35.95 | C7.1 53.89,37.38 53.66,37.15 51.12,37.15 50.8,37.47 50.8,40.64 51.12,40.96 51.12,44.29 U4.5 | C2.2 41.52,39.29 41.91,39.69 43.18,39.69 43.5,40.01 43.5,40.97 C3.2 43.53,43.47 v43.18,43.81 | U4.42 43.11,45.72 v42.55,45.72 41.16,44.33 40.17,44.33 39.73,44.77 39.73,46.7 40.44,47.41 40.44,49 38.63,50.81 38.63,54.9 38.99,55.26 C4.2 40.31,55.26 41.27,54.29 41.27,52.01 U4.35 | R38.2 53.02,63.18 53.66,62.55 53.66,61.59 53.98,61.28 C33.1 | U4.18 51.12,53.02 51.12,54.61 48.02,57.7 C5.2 47.51,59.97 46.86,59.97 46.51,60.32 45.58,60.32 v45.45,60.19 v45.45,60.18 | TR1.2 R43.2 23.89,67.63 22.26,66 21.66,66 ICSP.6 22.58,63.28 22.58,60.91 23.42,60.07 26.2,60.07 26.92,60.79 TR3.2 25.73,61.61 R41.2
  Top 0.254: R45.2 TR2.2 26.92,72.69 26.06,71.83 24.38,71.83 v24.36,71.81 | C6.2 7.62,66.67 5.71,68.58 3.43,68.58 TFT.4 3.24,68.58 1.91,68.58 1.27,69.22 1.27,73.03 2.96,74.71 RESET.1 | C7.1 C13.2 56.38,39.56 56.52,39.69 57.47,39.69 57.78,40.01 57.78,42.86 58.1,43.18 58.1,44.77 IC4.3 58.03,45.98 v56.82,47.19 | JTAG.3 JTAG.5 v18.37,68.41 v18.38,68.4 | Q2.E 35.09,72.91 35.65,72.35 36.6,72.35 v36.63,72.38 | Q1.E 35.42,67.63 36.15,68.36 36.15,70.29 v36.63,70.77 | Q11.E 38.66,61.6 39.08,62.02 41.11,62.02 41.76,62.67 51.88,62.67 R38.2 | IC7.10 IC7.5 71.03,72.07 71.68,71.42 | 71.68,71.42 71.68,69.88 71.31,69.51 69.72,69.51 IC7.3 | C49.2 70.41,76.17 v71.47,75.11 | v71.96,72.15 71.96,71.7 71.68,71.42 | v53.74,88.74 55.12,88.74 55.48,88.38 55.48,87.73 ON.C | H_IN.18 26.04,87.24 26.57,87.77 30.52,87.77 31.12,87.17 H_IN.22 | R38.2 52.39,63.81 51.75,64.45 51.75,68.05 v52.76,69.06 | C11.2 v72.14,45.72 | v60.75,54.64 60.75,54.85 60.36,55.24 | 48.9,35.95 C8.1
  Top 0.406: C27.1 C32.1 | C34.1 C29.1 61.7,61.47 C35.1 C30.1 C28.1 C33.1
  Top 0.61: 67.87,83.19 67.23,83.82 IC5.6 67.23,86.36 67.87,87 67.87,87.5 C47.2 | 67.87,83.19 69.14,83.19 69.78,82.55 69.78,79.69 70.41,79.06 | 70.41,79.06 C49.2 | 70.41,79.06 70.73,79.38 78.35,79.38 81.38,82.41 X4.3 78.52,85.41 X4.1 | 67.87,83.19 65.65,83.19 64.69,84.14 IC5.8 64.05,85.94 R32.1 62.92,86.07 C48.1
  Signals 0.254: v18.38,68.4 18.51,68.4 | v24.36,71.81 24.2,71.81 | v36.63,70.77 v36.63,72.38 | v57.11,78.48 57.11,78.33 | v71.47,75.11 71.47,72.64 v71.96,72.15 | H_IN.22 31.12,87.17 32,88.05 35.51,88.05 37.17,86.39 42.97,86.39 45.17,88.59 51.27,88.59 51.95,89.27 53.21,89.27 v53.74,88.74 | v66.31,44.99 67.04,45.72 v72.14,45.72 71.24,44.82 71.24,43.12 70.14,42.02 v66.13,42.02 | v60.59,50.51 60.59,50.53 61.18,51.12 61.18,53.12 60.75,53.55 v60.75,54.64
  Bottom 0.254: v65.33,31.43 64.06,32.7 64.06,37.47 v63.74,37.78 | v65.65,37.78 65.97,37.78 66.28,37.47 v66.28,35.56 67.55,34.29 v72.63,34.29 72.63,38.16 X2.2 | C17.1 61.39,48.71 | 61.39,48.71 61.84,48.26 C18.1 63.38,48.26 63.87,47.77 63.87,46.81 64.18,46.5 64.87,46.5 C15.1 65.95,46.36 66.31,46 v66.31,44.99 | C17.1 C14.1 58.33,48.69 58.33,47.57 57.95,47.19 v56.82,47.19 | D3.A 51.04,65.88 50.24,66.67 50.24,67.79 C36.2 51.64,67.95 v52.75,69.06 v52.76,69.06 | v43.18,43.81 43.18,45.09 v42.55,45.72 | 48.58,61.59 48.58,60.64 47.95,60.01 C52.2 47.33,59.37 46.82,59.88 46.82,60.02 46.55,60.29 45.56,60.29 v45.45,60.18 | 48.58,61.59 U3.9 | 48.58,61.59 48.58,62.23 48.15,62.66 U3.4 | C21.1 62.79,52.7 61.93,51.84 61.92,51.84 v60.59,50.51 60.57,50.49 C17.1 | 61.93,49.25 61.39,48.71 | 56.12,57.24 56.53,56.83 59.47,56.83 C19.1 60.57,54.82 v60.75,54.64 | SMA_GPS.GND@2 81.88,1.64 v81.89,1.62
  Bottom 0.406: 72.31,87 TVS1.A | C20.1 56.12,57.24 C22.1
  Bottom 0.61: C42.2 67.87,77.28 67.87,78.11 67.23,78.74 IC3.6 67.23,81.6 67.87,82.23 | R29.1 61.89,79.32 62.79,78.42 | 62.79,78.42 62.79,77.34 C43.1 | 62.79,78.42 64.3,79.93 IC3.8 64.69,81.6 65.33,82.23 67.87,82.23 | 67.87,82.23 68.82,82.23 70.09,83.5 70.09,84.77 72.31,87 | C44.2 71.2,88.11 72.31,87 | 72.31,87 78.11,87 X4.1
  pour Bottom: 49,46 49,48 49,49 55,49 55,35 50,35 50,44 50,45 49,45
  pour Top: 49,46 49,48 49,49 55,49 55,35 50,35 50,44 50,45 49,45
  pour Signals: 49,46 49,48 49,49 55,49 55,35 50,35 50,44 50,45 49,45
  pour Bottom: 49.5,43.5 49.5,35 39,35 39,57 0,57 0,90 45.5,90 45.5,64 53.5,64 53.5,59 54.5,59 54.5,49.5 48.5,49.5 48.5,44.5 49.5,44.5
  pour Top: 49.5,43.5 49.5,35 39,35 39,57 0,57 0,90 45.5,90 45.5,64 53.5,64 53.5,59 54.5,59 54.5,49.5 48.5,49.5 48.5,44.5 49.5,44.5
  pour Signals: 49.5,43.5 49.5,35 39,35 39,57 0,57 0,90 45.5,90 45.5,64 53.5,64 53.5,59 54.5,59 54.5,49.5 48.5,49.5 48.5,44.5 49.5,44.5
  pour Bottom: 39,34.5 60,34.5 60,29 85,29 85,0 39,0
  pour Top: 39,34.5 60,34.5 60,29 85,29 85,0 39,0
  pour Signals: 39,34.5 60,34.5 60,29 85,29 85,0 39,0
  pour Bottom: 55.5,35 61,35 61,30 85,30 85,90 46.5,90 46.5,64.5 54.5,64.5 54.5,60 55.5,60
  pour Top: 55.5,35 61,35 61,30 85,30 85,90 46.5,90 46.5,64.5 54.5,64.5 54.5,60 55.5,60
  pour Signals: 55.5,35 61,35 61,30 85,30 85,90 46.5,90 46.5,64.5 54.5,64.5 54.5,60 55.5,60
HREF  (via drill 0.2 layers 1-2)
  Top 0.254: v45.72,51.75 45.72,51.81 U4.29
  Power 0.254: H_IN.6 11.02,86.45 12.06,85.41 12.06,77.79 13.65,76.2 25.72,76.2 29.84,72.07 29.84,66.99 33.97,62.87 36.83,62.87 41.59,58.1 43.5,58.1 45.09,56.52 45.09,52.39 v45.72,51.75
K1_C
  Top 1.778: X5.2 K1.P
K1_NC
  Top 1.778: X5.3 12.3,53.26 13.34,54.29 20.01,54.29 K1.S
K1_NO
  Top 1.778: X5.1 12.62,43.26 13.65,42.23 20.01,42.23 K1.O
K2_C
  Top 1.778: X6.2 34.03,29.21 K2.P
K2_NC
  Top 1.778: X6.3 13.57,34.21 14.61,35.24 19.77,35.24 K2.S
K2_NO
  Top 1.778: X6.1 12.3,24.21 13.02,23.5 19.77,23.5 K2.O
K3_C
  Top 1.778: X7.2 K3.P
K3_NC
  Top 1.778: X7.3 13.26,15.16 14.29,16.19 19.85,16.19 K3.S
K3_NO
  Top 1.778: X7.1 12.94,5.16 13.97,4.13 19.85,4.13 K3.O
MISO  (via drill 0.2)
  Top 0.254: U4.21 48.53,52.55 48.53,51.72 47.62,50.81 v47.62,50.8 | v47.62,55.24 45.72,57.15 41.91,57.15 41.27,57.78 22.86,57.78 22.54,58.1 18.73,58.1 17.14,59.69 17.14,61.91 16.5,62.56 ICSP.1
  Bottom 0.254: v47.62,55.24 48.58,54.29 48.58,51.75 v47.62,50.8
MOSI  (via drill 0.2)
  Top 0.254: ICSP.4 18.22,64.96 19.37,63.82 19.37,60.01 20,59.37 23.18,59.37 23.5,59.05 42.23,59.05 42.86,58.42 46.35,58.42 v46.99,57.78 | v48.08,48.74 48.1,48.74 48.81,49.45 48.81,49.99 49.01,50.19 49.01,50.85 49.39,51.23 49.39,52 U4.19
  Bottom 0.254: v46.99,57.78 47.94,57.78 48.58,57.15 48.58,56.2 49.85,54.93 49.85,50.7 49.4,50.25 49.4,50.06 v48.08,48.74
N$1
  Top 0.254: C3.1 41.63,43.53 U4.43
N$2
  Top 0.254: C8.2 46.99,35.88 45.72,37.15 45.72,40.01 46.35,40.64 46.45,40.64 Y1.P$2 46.77,42.01 47.31,42.55 48.26,42.55 48.9,43.18 48.9,43.69 U4.1
N$3
  Top 0.254: C10.2 51.44,35.88 50.16,37.15 50.16,44.54 U4.4
N$4  (via drill 0.2)
  Top 0.254: v57.15,85.72 57.15,84.77 56.83,84.45 !RESET.C
  Bottom 0.254: R3.2 56.67,84.45 57.15,84.93 v57.15,85.72
N$5
  Top 0.254: C9.2 48.97,39.45 49.21,39.69 49.21,40.9 | 49.21,40.9 Y1.P$1 | 49.21,40.9 49.21,42.55 49.53,42.86 49.53,43.76 U4.2
N$6
  Top 0.254: C7.2 52.17,38.6 L1.2 52.17,43.94 U4.6
N$7
  Top 0.254: R4.1 71.36,47.94 72.31,48.9 72.31,50.55 X1.1
N$8
  Top 0.254: R4.2 C11.1 66.6,46.67 64.69,46.67 64.06,46.04 IC1.3
N$9
  Top 0.254: C12.1 56.38,42.1 56.83,42.55 56.83,44.77 IC4.2
N$10
  Top 0.254: C12.2 59.19,42.67 59.37,42.86 59.37,44.77 IC4.4
N$11
  Top 0.254: X2.1 73.52,36.51 R11.2 R12.1
N$12
  Top 0.254: R11.1 66.6,36.51 65.97,37.15 64.38,37.15 64.06,36.83 IC6.3
N$13
  Top 0.254: R5.1 68.5,51.75 66.92,53.34 R6.1
N$14
  Top 0.254: R7.2 66.92,55.56 68.19,56.83 R5.3
N$15  (via drill 0.2, 0.2 layers 1-2)
  Top 0.254: R16.1 v46.75,83.5 | v59.13,66.99 IC8.10
  Power 0.254: v46.75,83.5 48.34,83.5 48.98,82.87 48.98,67.94 52.15,64.77 v52.78,64.77
  Bottom 0.254: v52.78,64.77 53.74,65.72 57.55,65.72 58.82,66.99 v59.13,66.99
N$16
  Top 0.254: R14.1 R13.2 66.6,33.34 63.42,33.34 62.79,33.97 IC6.2
N$17  (via drill 0.2)
  Top 0.254: R15.1 66.6,43.18 65.97,42.55 64.69,42.55 64.06,41.91 IC6.6 64.06,39.37 v64.69,38.73 | v71.05,32.07 R14.2
  Bottom 0.254: v64.69,38.73 64.69,33.34 65.97,32.07 v71.05,32.07
N$18  (via drill 0.2, 0.2 layers 1-2)
  Top 0.254: v59.13,65.72 IC8.9
  Power 0.254: v46.75,84.77 48.98,84.77 49.61,84.14 49.61,68.26 52.15,65.72 v59.13,65.72
  Bottom 0.254: C31.1 47.7,85.72 v46.75,84.77
N$19  (via drill 0.2 layers 1-2)
  Top 0.254: R19.1 51.83,81.28 v52.15,80.96 | R18.2 50.4,87.63 51.44,87.63 v52.39,88.58 | v67.71,68.26 IC7.2
  Power 0.254: v67.71,68.26 67.39,68.26 65.8,69.85 55.01,69.85 54.05,70.8 54.05,73.98 52.78,75.25 52.78,78.74 52.15,79.38 v52.15,80.96 51.59,81.52 51.59,87.79 v52.39,88.58
N$20  (via drill 0.2 layers 1-2)
  Top 0.254: R17.2 v46.75,85.72 | v59.13,68.26 IC8.11
  Power 0.254: v46.75,85.72 49.61,85.72 50.24,85.09 50.24,68.58 52.47,66.36 57.23,66.36 v59.13,68.26
N$21  (via drill 0.2 layers 1-2)
  Top 0.254: R18.1 v46.75,87.95 | v53.1,66.99 IC8.7
  Power 0.254: v46.75,87.95 49.93,87.95 50.88,87 50.88,69.22 v53.1,66.99
N$22  (via drill 0.2)
  Top 0.254: R21.2 R23.1 R22.1 47.7,72.39 v46.75,71.44 | v62.63,73.34 IC7.9
  Bottom 0.254: v46.75,71.44 57.55,71.44 58.82,72.71 61.99,72.71 v62.63,73.34
N$23  (via drill 0.2)
  Top 0.254: R21.1 R20.2 v51.52,79.06 | v67.71,74.61 IC7.7
  Bottom 0.254: v51.52,79.06 55.96,74.61 v67.71,74.61
N$24  (via drill 0.2)
  Top 0.254: R24.1 R22.2 v52.47,72.39
  Bottom 0.254: v52.47,72.39 51.35,72.39 D1.A
N$25  (via drill 0.2)
  Top 0.254: v52.07,75.88 58.26,75.88 58.58,75.56 62.23,75.56 63.18,74.61 IC7.8
  Bottom 0.254: D1.C D2.A 47.23,75.33 47.78,75.88 v52.07,75.88
N$26  (via drill 0.2, 0.2 layers 1-2)
  Top 0.254: R23.2 v52.47,74.61 | IC7.12 63.26,69.53 v62.95,69.22
  Power 0.254: v62.95,69.22 54.69,69.22 53.42,70.48 53.42,73.66 v52.47,74.61
  Bottom 0.254: v52.47,74.61 D2.C
N$27  (via drill 0.2)
  Top 0.254: R25.1 R24.2 v46.75,70.17 | v62.63,68.26 IC7.13
  Bottom 0.254: v46.75,70.17 57.55,70.17 58.5,69.22 61.67,69.22 v62.63,68.26
N$28  (via drill 0.2)
  Top 0.254: R25.2 R26.1 50.24,65.56 v50.24,64.14 | IC7.14 v62.63,66.99
  Bottom 0.254: v62.63,66.99 61.36,66.99 59.45,65.09 54.37,65.09 53.42,64.14 v50.24,64.14
N$29  (via drill 0.2 layers 1-2)
  Top 0.254: R1.1 54.8,34 54.13,33.34 54.13,31.27 52.7,29.84 52.7,28.22 LORA_ICSP.1 | U1.32 58.9,24.81 58.9,25.88 59.05,26.04 59.53,26.04 v59.85,26.35
  Power 0.254: LORA_ICSP.1 52.77,27.4 53.66,26.51 56.52,26.51 56.99,26.04 59.53,26.04 v59.85,26.35
N$30  (via drill 0.2)
  Top 0.254: U1.30 61.47,26.95 v61.44,26.99
  Bottom 0.254: v61.44,26.99 60.33,26.99 59.85,27.46 56.04,27.46 55.4,28.1 54.29,28.1 53.98,28.42 53.98,29.69 53.18,30.48 43.34,30.48 42.55,29.69 42.55,28.22 LORA_ICSP.5
N$31  (via drill 0.2)
  Top 0.254: v60.8,26.35 60.33,25.88 60.33,24.89 U1.31
  Bottom 0.254: LORA_ICSP.4 45.15,26.92 45.88,26.19 58.42,26.19 58.74,25.88 60.33,25.88 v60.8,26.35
N$32
  Top 0.254: U1.23 67.05,14.61 arc-90 69.08,12.58 69.08,7.78 arc90 71.08,5.78 74.58,5.78 L2.1 74.54,5.82 74.54,6.67 74.22,6.99 C40.1
N$33
  Top 0.254: C41.1 76.76,6.99 76.44,6.67 76.44,5.82 L2.2 81.8,5.71 SMA_GPS.SIG
N$34
  Bottom 0.61: IC3.3 67.23,86.04 68.19,87 C44.1
N$35
  Bottom 0.61: C45.1 IC3.2
N$36
  Bottom 0.61: IC3.1 64.69,86.36 64.06,87 C45.2 62.19,88.1 L3.P$1
N$37
  Bottom 0.61: R29.2 C46.1 59.72,82.97 R30.1 61.94,82.87 62.47,82.87 62.79,83.19 68.19,83.19 68.5,83.5 IC3.4
N$38
  Top 0.61: IC5.3 67.23,78.74 67.55,78.42 68.19,78.42 68.5,78.11 C49.1
N$39
  Top 0.61: IC5.2 65.97,78.42 66.28,78.11 C50.1
N$40
  Top 0.61: IC5.1 64.69,78.42 64.38,78.11 C50.2 62.79,77.15 62.47,77.47 L4.P$1
N$41
  Top 0.61: 59.93,80.33 R31.1 60.15,80.33 62.47,80.33 64.38,82.23 | 64.38,82.23 67.87,82.23 68.5,81.6 IC5.4 | C51.1 60.89,85.72 61.52,85.09 61.52,84.45 61.84,84.14 62.69,84.14 R32.2 62.79,83.82 64.38,82.23
N$42  (via drill 0.2)
  Top 0.254: 5V.A 52.7,81.92 v52.39,82.23
  Bottom 0.254: v52.39,82.23 52.7,81.92 R33.2
N$43  (via drill 0.2)
  Top 0.254: 3V3.A 53.8,77.8 v53.82,77.79
  Bottom 0.254: v53.82,77.79 53.82,79.29 R34.2
N$44
  Top 0.254: R38.1 R39.1 52.39,52.88 U4.16
N$45
  Top 0.254: TR3.1 30.19,62.57 R40.2 33.04,63.5 D11.A
N$46
  Top 0.254: Q11.B 34.45,63.5 33.34,62.39 D11.C
N$48  (via drill 0.2)
  Top 0.254: Q11.C 38.73,62.55 39.53,63.34 39.69,63.5 | 39.69,63.5 D4.A | v41.27,63.5 39.69,63.5
  Bottom 0.254: K1.2 32.24,55.42 33.02,56.2 35.56,56.2 37.15,57.78 37.15,60.96 37.47,61.28 39.05,61.28 v41.27,63.5
N$49
  Top 0.254: TR1.1 30.04,68.61 R42.2 31.26,69.83 D6.A
N$50
  Top 0.254: Q1.B 34.29,69.53 33.34,68.58 D6.C
N$52  (via drill 0.2)
  Top 0.254: D5.A 39.69,69.22 39.05,68.58 Q1.C 37.78,68.09 v37.78,66.99
  Bottom 0.254: K2.2 30.04,35.36 28.89,36.51 28.89,55.56 30.48,57.15 35.24,57.15 36.51,58.42 36.51,65.72 v37.78,66.99
N$53
  Top 0.254: TR2.1 30.19,74.64 R44.2 31.41,75.86 D8.A
N$54
  Top 0.254: Q2.B 34.6,75.56 33.34,74.3 D8.C
N$56  (via drill 0.2)
  Top 0.254: Q2.C 37.78,74.61 | 37.78,74.61 39.05,74.61 39.69,75.25 D7.A | v37.78,73.34 37.78,74.61
  Bottom 0.254: K3.2 30.2,16.15 28.89,17.46 28.89,34.92 27.94,35.88 27.94,55.88 30.16,58.1 34.92,58.1 35.88,59.05 35.88,66.36 37.47,67.94 37.47,73.03 v37.78,73.34
N$57  (via drill 0.2)
  Top 0.254: v52.31,87.31 ON.A
  Bottom 0.254: R46.2 v52.31,87.31
N$58  (via drill 0.2)
  other vias: 73,16
N$59  (via drill 0.2)
  other vias: 75,16
N$60  (via drill 0.2)
  other vias: 75,18
N$61  (via drill 0.2)
  other vias: 73,18
N$62  (via drill 0.2)
  other vias: 73,22
N$63  (via drill 0.2)
  other vias: 73,20
N$64  (via drill 0.2)
  other vias: 75,20
N$65  (via drill 0.2)
  other vias: 75,22
N$66  (via drill 0.2)
  other vias: 75,24
N$67  (via drill 0.2)
  other vias: 73,24
N$68  (via drill 0.2)
  other vias: 73,26
N$69  (via drill 0.2)
  other vias: 75,26
N$70  (via drill 0.2)
  other vias: 71,26
N$71  (via drill 0.2)
  other vias: 71,24
N$72  (via drill 0.2)
  other vias: 71,22
N$73  (via drill 0.2)
  other vias: 71,20
N$74  (via drill 0.2)
  other vias: 71,18
N$75  (via drill 0.2)
  other vias: 71,16
N$76  (via drill 0.2)
  other vias: 75,14
N$77  (via drill 0.2)
  other vias: 73,14
N$78  (via drill 0.2)
  other vias: 71,14
N$79  (via drill 0.2)
  other vias: 71,12
N$80  (via drill 0.2)
  other vias: 73,12
N$81  (via drill 0.2)
  other vias: 75,12
N$82  (via drill 0.2)
  other vias: 77,12
N$83  (via drill 0.2)
  other vias: 77,14
N$84  (via drill 0.2)
  other vias: 77,16
N$85  (via drill 0.2)
  other vias: 77,18
N$86  (via drill 0.2)
  other vias: 77,20
N$87  (via drill 0.2)
  other vias: 77,22
N$88  (via drill 0.2)
  other vias: 77,24
N$89  (via drill 0.2)
  other vias: 77,26
N$90  (via drill 0.2)
  other vias: 79,12
N$91  (via drill 0.2)
  other vias: 79,14
N$92  (via drill 0.2)
  other vias: 79,16
N$93  (via drill 0.2)
  other vias: 79,18
N$94  (via drill 0.2)
  other vias: 79,20
N$95  (via drill 0.2)
  other vias: 79,22
N$96  (via drill 0.2)
  other vias: 79,24
N$97  (via drill 0.2)
  other vias: 79,26
N$98  (via drill 0.2)
  other vias: 81,26
N$99  (via drill 0.2)
  other vias: 81,24
N$100  (via drill 0.2)
  other vias: 81,22
N$101  (via drill 0.2)
  other vias: 81,20
N$102  (via drill 0.2)
  other vias: 81,18
N$103  (via drill 0.2)
  other vias: 81,16
N$104  (via drill 0.2)
  other vias: 81,14
N$105  (via drill 0.2)
  other vias: 81,12
N$106  (via drill 0.2)
  other vias: 69,26
N$107  (via drill 0.2)
  other vias: 67,26
N$108  (via drill 0.2)
  other vias: 67,24
N$109  (via drill 0.2)
  other vias: 69,24
N$110  (via drill 0.2)
  other vias: 69,22
N$111  (via drill 0.2)
  other vias: 67,22
N$112  (via drill 0.2)
  other vias: 67,20
N$113  (via drill 0.2)
  other vias: 69,20
N$114  (via drill 0.2)
  other vias: 69,18
N$115  (via drill 0.2)
  other vias: 67,18
N$116  (via drill 0.2)
  other vias: 71,10
N$117  (via drill 0.2)
  other vias: 71,8
N$118  (via drill 0.2)
  other vias: 81,10
N$119  (via drill 0.2)
  other vias: 79,10
N$120  (via drill 0.2)
  other vias: 83,10
N$121  (via drill 0.2)
  other vias: 83,12
N$122  (via drill 0.2)
  other vias: 83,14
N$123  (via drill 0.2)
  other vias: 83,16
N$124  (via drill 0.2)
  other vias: 83,18
N$125  (via drill 0.2)
  other vias: 83,20
N$126  (via drill 0.2)
  other vias: 83,22
N$127  (via drill 0.2)
  other vias: 83,24
N$128  (via drill 0.2)
  other vias: 83,26
N$129  (via drill 0.2)
  other vias: 67,16
N$130  (via drill 0.2)
  other vias: 69,16
N$131  (via drill 0.2)
  other vias: 67,14
N$132  (via drill 0.2)
  other vias: 67,12
N$133  (via drill 0.2)
  other vias: 67,10
N$134  (via drill 0.2)
  other vias: 67,8
N$135  (via drill 0.2)
  other vias: 67,6
N$136  (via drill 0.2)
  other vias: 69,6
N$137  (via drill 0.2)
  other vias: 67,4
N$138  (via drill 0.2)
  other vias: 69,4
N$139  (via drill 0.2)
  other vias: 71,4
N$140  (via drill 0.2)
  other vias: 73,4
N$141  (via drill 0.2)
  other vias: 75,4
N$142  (via drill 0.2)
  other vias: 77,4
N$143  (via drill 0.2)
  other vias: 79,4
N$144  (via drill 0.2)
  other vias: 79,2
N$145  (via drill 0.2)
  other vias: 77,2
N$146  (via drill 0.2)
  other vias: 75,2
N$147  (via drill 0.2)
  other vias: 73,2
N$148  (via drill 0.2)
  other vias: 71,2
N$149  (via drill 0.2)
  other vias: 69,2
N$150  (via drill 0.2)
  other vias: 67,2
N$151  (via drill 0.2)
  other vias: 65,26
N$152  (via drill 0.2)
  other vias: 65,22
N$153  (via drill 0.2)
  other vias: 63,22
N$154  (via drill 0.2)
  other vias: 63,20
N$155  (via drill 0.2)
  other vias: 63,18
N$156  (via drill 0.2)
  other vias: 63,16
N$157  (via drill 0.2)
  other vias: 63,14
N$158  (via drill 0.2)
  other vias: 63,12
N$159  (via drill 0.2)
  other vias: 63,10
N$160  (via drill 0.2)
  other vias: 65,10
N$161  (via drill 0.2)
  other vias: 65,8
N$162  (via drill 0.2)
  other vias: 65,24
N$163  (via drill 0.2)
  other vias: 61,10
N$164  (via drill 0.2)
  other vias: 61,12
N$165  (via drill 0.2)
  other vias: 61,14
N$166  (via drill 0.2)
  other vias: 61,16
N$167  (via drill 0.2)
  other vias: 61,18
N$168  (via drill 0.2)
  other vias: 61,20
N$169  (via drill 0.2)
  other vias: 61,22
N$170  (via drill 0.2)
  other vias: 65,28
N$171  (via drill 0.2)
  other vias: 67,28
N$172  (via drill 0.2)
  other vias: 69,28
N$173  (via drill 0.2)
  other vias: 71,28
N$174  (via drill 0.2)
  other vias: 73,28
N$175  (via drill 0.2)
  other vias: 75,28
N$176  (via drill 0.2)
  other vias: 77,28
N$177  (via drill 0.2)
  other vias: 79,28
N$178  (via drill 0.2)
  other vias: 81,28
N$179  (via drill 0.2)
  other vias: 83,28
N$180  (via drill 0.2)
  other vias: 63,28
N$181  (via drill 0.2)
  other vias: 61,28
N$182  (via drill 0.2)
  other vias: 61,4
N$183  (via drill 0.2)
  other vias: 63,4
N$184  (via drill 0.2)
  other vias: 65,4
N$185  (via drill 0.2)
  other vias: 65,2
N$186  (via drill 0.2)
  other vias: 63,2
N$187  (via drill 0.2)
  other vias: 61,2
OD_OUT  (via drill 0.2)
  Top 0.254: C26.1 R15.2 69.45,44.21 v69.22,44.45 | v53.98,45.09 53.15,45.09 U4.9
  Signals 0.254: v69.22,44.45 62.55,44.45 61.28,43.18 55.88,43.18 v53.98,45.09
PCLK  (via drill 0.2 layers 1-2)
  Top 0.254: v46.67,51.75 46.48,51.75 U4.28
  Power 0.254: H_IN.7 13.34,78.1 14.29,77.15 26.35,77.15 30.8,72.71 30.8,67.31 34.29,63.82 37.15,63.82 41.91,59.05 43.5,59.05 45.72,56.83 45.72,52.7 v46.67,51.75
PH_OUT  (via drill 0.2)
  Top 0.254: R10.1 62.47,58.1 60.88,56.52 58.34,56.52 58.03,56.83 IC2.6 58.03,59.3 v58.74,60.01 | v53.34,46.04 52.91,46.04 U4.10
  Signals 0.254: v58.74,60.01 58.1,59.37 58.1,47.62 55.88,45.4 54.93,45.4 54.29,46.04 v53.34,46.04
RELAY1  (via drill 0.2 layers 1-2)
  Top 0.254: R41.1 24.81,63.54 TR3.3 27.27,63.54 27.94,62.87 27.94,60.96 28.89,60.01 37.93,60.01 38.37,59.57 46.16,59.57 v46.2,59.53 | v45.4,49.69 45.4,48.72 U4.41
  Power 0.254: v46.2,59.53 47.15,59.53 51.44,55.24 51.44,53.18 49.85,51.59 48.1,51.59 47.94,51.44 47.15,51.44 v45.4,49.69
RELAY2  (via drill 0.2 layers 1-2)
  Top 0.254: R43.1 25.44,69.57 TR1.3 27.58,69.57 27.94,69.22 27.94,66.67 29.05,65.56 44.93,65.56 v46.04,64.45 | v53.82,47.94 53.34,47.94 53.02,47.62 52.73,47.62 U4.12
  Power 0.254: v46.04,64.45 46.04,62.87 47.15,61.75 49.05,61.75 53.18,57.63 53.18,55.88 55.56,53.5 55.56,49.69 v53.82,47.94
RELAY3  (via drill 0.2 layers 1-2)
  Top 0.254: R45.1 26.88,75.56 TR2.3 27.58,75.6 27.94,75.25 27.94,72.71 29.05,71.6 v45.4,71.6 | v48.42,47.78 48.42,46.83 48.1,46.51 48.1,45.89 U4.3
  Power 0.254: v45.4,71.6 45.4,66.67 44.77,66.04 44.77,61.75 45.72,60.8 48.1,60.8 52.23,56.67 52.23,53.02 49.85,50.64 49.85,49.21 v48.42,47.78
RX  (via drill 0.2)
  Top 0.254: TFT.1 11.65,60.86 13.34,62.55 13.34,65.72 14.61,66.99 22.23,66.99 23.18,67.94 23.18,76.83 24.13,77.79 v44.77,77.79 | v47.31,45.72 47.31,45.67 U4.48
  Bottom 0.254: v47.31,45.72 43.81,49.21 43.81,54.29 45.09,55.56 45.09,56.52 44.13,57.47 44.13,77.15 v44.77,77.79
RX1  (via drill 0.2)
  Top 0.254: U1.6 46.23,5.52 v46.35,5.4 | v40.64,45.4 40.64,45.72 41.27,46.35 41.27,46.71 U4.38
  Signals 0.254: v46.35,5.4 46.04,5.71 46.04,21.27 41.27,26.04 41.27,30.8 41.91,31.43 41.91,44.13 v40.64,45.4
SCK  (via drill 0.2)
  Top 0.254: ICSP.3 18.22,59.88 19.37,58.74 22.86,58.74 23.18,58.42 41.91,58.42 42.55,57.78 46.04,57.78 46.67,57.15 v47.62,57.15 | v47.94,49.85 47.94,49.87 48.51,50.44 48.51,51.04 48.97,51.5 48.97,52.29 U4.20
  Bottom 0.254: v47.62,57.15 47.62,56.2 49.21,54.61 49.21,51.12 v47.94,49.85
SCL  (via drill 0.2)
  Top 0.254: U4.14 52.7,51.78 v52.7,52.39 53.34,53.02 v54.29,53.02
  Bottom 0.254: v52.7,52.39 52.7,59.37 52.07,60.01 52.07,61.28 51.19,62.16 U3.6 | R35.2 57.15,60.64 56.52,60.01 55.24,60.01 54.61,59.37 54.61,53.34 v54.29,53.02
SDA  (via drill 0.2)
  Top 0.254: v53.66,52.07 53.66,52.02 U4.13
  Bottom 0.254: 53.66,59.37 v53.66,52.07 | R36.2 54.93,60.64 53.66,59.37 | U3.5 51.64,62.66 52.7,61.59 52.7,60.33 53.66,59.37
SIOC  (via drill 0.2 layers 1-2)
  Top 0.254: v41.91,53.98 41.91,53.5 U4.32 | R27.2 8.89,75.56 7.94,76.52 7.94,80.33 8.26,80.64 H_IN.3
  Power 0.254: H_IN.3 8.26,77.78 12.7,73.34 24.13,73.34 26.99,70.48 26.99,64.45 32.07,59.37 36.51,59.37 v41.91,53.98
SIOD  (via drill 0.2 layers 1-2)
  Top 0.254: v42.86,53.98 42.86,53.25 U4.31 | R28.2 9.21,80.33 9.53,80.64 9.53,85.18 H_IN.4
  Power 0.254: H_IN.4 8.48,86.45 9.53,85.41 9.53,77.79 13.02,74.3 24.77,74.3 27.94,71.12 27.94,65.09 32.7,60.33 36.51,60.33 v42.86,53.98
SWCLK  (via drill 0.2 layers 1-2)
  Top 0.254: v45.09,43.66 44.29,44.45 44.29,44.78 U4.45
  Power 0.254: JTAG.4 17.1,71.8 16.67,72.23 14.76,72.23 12.86,70.33 12.86,58.1 14.61,56.36 24.45,56.36 26.51,54.29 26.51,41.27 29.21,38.58 40.8,38.58 45.09,42.86 v45.09,43.66
SWDIO  (via drill 0.2 layers 1-2)
  Top 0.254: v47.15,47.94 46.67,47.47 46.67,46.83 46.2,46.35 46.2,45.98 U4.46
  Power 0.254: JTAG.2 14.94,71.14 13.65,69.85 13.65,58.58 14.92,57.31 24.92,57.31 27.62,54.61 27.62,41.59 29.84,39.37 40.64,39.37 44.45,43.18 44.45,44.29 45.88,45.72 45.88,46.67 v47.15,47.94
TEMP  (via drill 0.2)
  Top 0.254: R39.2 51.12,56.84 v50.8,57.15 | R37.1 v13.02,71.75
  Signals 0.254: v50.8,57.15 50.8,60.01 46.99,63.82 45.72,63.82 43.81,65.72 43.81,83.19 41.91,85.09 36.2,85.09 34.92,86.36 33.75,86.36 H_IN.24
  Bottom 0.254: v13.02,71.75 13.34,71.75 14.61,73.03 14.61,87 16.19,88.58 33.02,88.58 33.66,87.95 H_IN.24
TL081REL  (via drill 0.2)
  Top 0.254: v63.11,59.69 65.01,59.69 65.33,59.37 R10.2 65.33,57.15 65.01,56.83 62.16,56.83 61.2,55.88 58.03,55.88 56.76,54.61 IC2.2 56.76,52.07 56.28,51.59 v54.69,51.59
  Bottom 0.254: R8.2 60.25,58.74 60.88,59.37 62.79,59.37 v63.11,59.69 | v54.69,51.59 58.03,51.59 58.34,51.91 R9.2
TRIG  (via drill 0.2)
  Top 0.254: v51.75,45.4 51.75,45.78 U4.8
  Signals 0.254: H_IN.23 40.87,83.91 42.55,82.23 42.55,65.09 45.4,62.23 47.31,62.23 49.85,59.69 49.85,47.62 51.75,45.72 v51.75,45.4
TX  (via drill 0.2)
  Top 0.254: TFT.2 3.33,62.7 3.81,62.23 5.4,62.23 6.03,61.59 11.43,61.59 12.7,62.87 12.7,66.04 14.29,67.63 21.91,67.63 22.54,68.26 22.54,77.15 23.81,78.42 v45.72,78.42 | v47.62,46.99 46.67,46.04 46.67,45.75 U4.47
  Bottom 0.254: v45.72,78.42 45.72,77.47 44.77,76.52 44.77,57.78 45.72,56.83 45.72,55.24 44.45,53.98 44.45,49.53 46.99,46.99 v47.62,46.99
TX1  (via drill 0.2)
  Top 0.254: U1.7 47.5,5.52 v47.62,5.4 | v40.64,46.67 40.64,46.78 U4.37
  Signals 0.254: v47.62,5.4 47.31,5.71 47.31,22.54 43.81,26.04 43.81,30.16 42.55,31.43 42.55,44.77 v40.64,46.67
VSYNC  (via drill 0.2 layers 1-2)
  Top 0.254: v45.09,51.12 45.09,51.75 45.07,51.75 U4.30
  Power 0.254: H_IN.5 10.8,77.78 13.34,75.25 25.08,75.25 28.89,71.44 28.89,66.04 33.34,61.59 36.51,61.59 43.5,54.61 43.5,53.34 45.09,51.75 v45.09,51.12
XCLK  (via drill 0.2, 0.2 layers 2-15)
  Top 0.254: U4.27 45.95,52.99 45.95,52.8 46.35,52.4 46.35,52.39 46.99,52.39 47.31,52.07 v47.62,52.07
  Power 0.254: H_IN.8 13.56,86.45 14.61,85.41 14.61,78.74 15.24,78.11 26.99,78.11 31.75,73.34 31.75,67.94 34.61,65.09 37.15,65.09 v42.23,60.01
  Signals 0.254: v42.23,60.01 43.81,60.01 46.35,57.47 46.35,55.56 48.26,53.66 48.26,52.7 v47.62,52.07